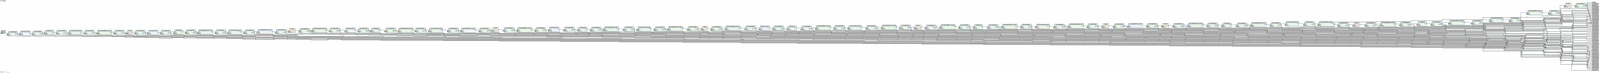
[diagram p0: block diagram of the top level, whole]
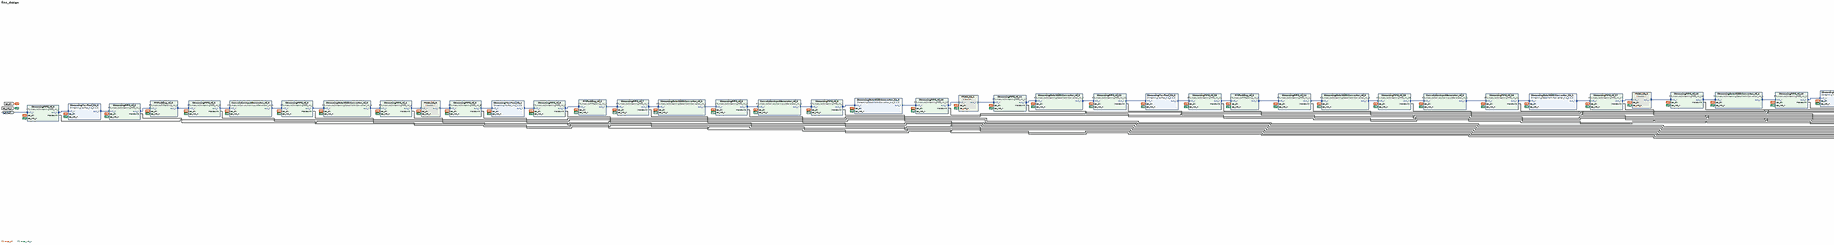
[diagram p1: block diagram of the top level, left part]
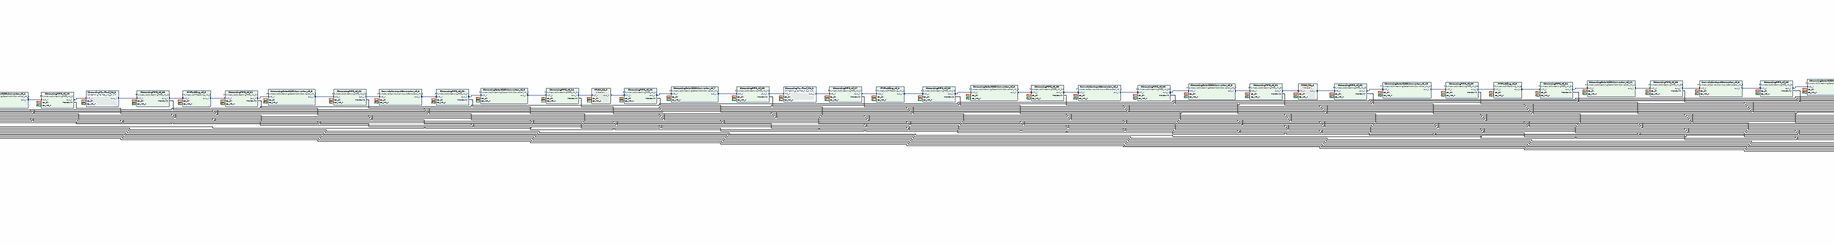
[diagram p2: block diagram of the top level, centre part]
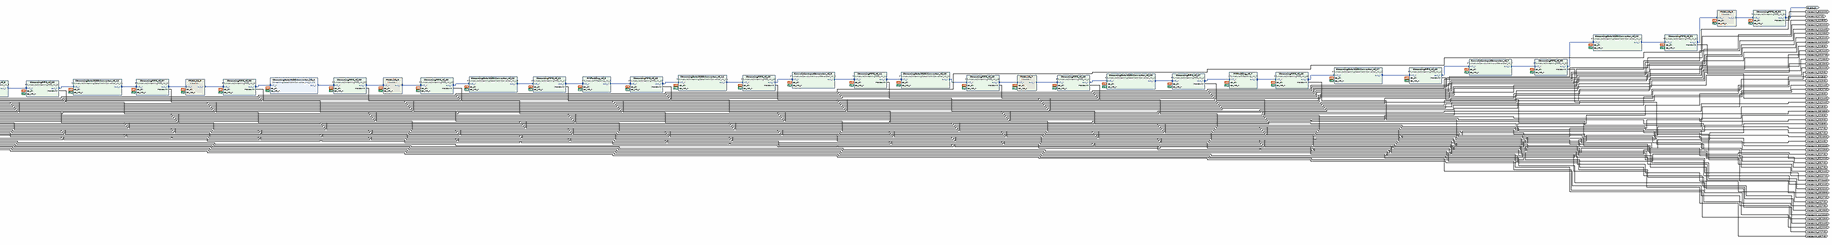
[diagram p3: block diagram of the top level, right part]
# Vivado block design finn_design, xc7z020clg400-1, Vivado 2022.2
create_bd_design finn_design

create_bd_intf_port -mode Slave -vlnv xilinx.com:interface:axis_rtl:1.0 s_axis_0
set_property -dict [list \
  CONFIG.HAS_TKEEP 0 \
  CONFIG.HAS_TLAST 0 \
  CONFIG.HAS_TREADY 1 \
  CONFIG.HAS_TSTRB 0 \
  CONFIG.LAYERED_METADATA undef \
  CONFIG.TDATA_NUM_BYTES 3 \
  CONFIG.TDEST_WIDTH 0 \
  CONFIG.TID_WIDTH 0 \
  CONFIG.TUSER_WIDTH 0 \
] [get_bd_intf_ports s_axis_0]
create_bd_intf_port -mode Master -vlnv xilinx.com:interface:axis_rtl:1.0 m_axis_0
create_bd_port -dir I -type clk ap_clk
set_property -dict {CONFIG.FREQ_HZ 100000000} [get_bd_ports ap_clk]
create_bd_port -dir I -type rst ap_rst_n
create_bd_port -dir O -from 17 -to 0 maxcount
create_bd_port -dir O -from 15 -to 0 maxcount_1
create_bd_port -dir O -from 15 -to 0 maxcount_2
create_bd_port -dir O -from 15 -to 0 maxcount_3
create_bd_port -dir O -from 18 -to 0 maxcount_4
create_bd_port -dir O -from 15 -to 0 maxcount_5
create_bd_port -dir O -from 13 -to 0 maxcount_6
create_bd_port -dir O -from 13 -to 0 maxcount_7
create_bd_port -dir O -from 14 -to 0 maxcount_8
create_bd_port -dir O -from 17 -to 0 maxcount_9
create_bd_port -dir O -from 16 -to 0 maxcount_10
create_bd_port -dir O -from 14 -to 0 maxcount_11
create_bd_port -dir O -from 13 -to 0 maxcount_12
create_bd_port -dir O -from 11 -to 0 maxcount_13
create_bd_port -dir O -from 11 -to 0 maxcount_14
create_bd_port -dir O -from 14 -to 0 maxcount_15
create_bd_port -dir O -from 17 -to 0 maxcount_16
create_bd_port -dir O -from 15 -to 0 maxcount_17
create_bd_port -dir O -from 13 -to 0 maxcount_18
create_bd_port -dir O -from 11 -to 0 maxcount_19
create_bd_port -dir O -from 9 -to 0 maxcount_20
create_bd_port -dir O -from 9 -to 0 maxcount_21
create_bd_port -dir O -from 14 -to 0 maxcount_22
create_bd_port -dir O -from 17 -to 0 maxcount_23
create_bd_port -dir O -from 14 -to 0 maxcount_24
create_bd_port -dir O -from 13 -to 0 maxcount_25
create_bd_port -dir O -from 9 -to 0 maxcount_26
create_bd_port -dir O -from 7 -to 0 maxcount_27
create_bd_port -dir O -from 7 -to 0 maxcount_28
create_bd_port -dir O -from 13 -to 0 maxcount_29
create_bd_port -dir O -from 16 -to 0 maxcount_30
create_bd_port -dir O -from 13 -to 0 maxcount_31
create_bd_port -dir O -from 12 -to 0 maxcount_32
create_bd_port -dir O -from 7 -to 0 maxcount_33
create_bd_port -dir O -from 7 -to 0 maxcount_34
create_bd_port -dir O -from 14 -to 0 maxcount_35
create_bd_port -dir O -from 17 -to 0 maxcount_36
create_bd_port -dir O -from 14 -to 0 maxcount_37
create_bd_port -dir O -from 11 -to 0 maxcount_38
create_bd_port -dir O -from 12 -to 0 maxcount_39
create_bd_port -dir O -from 13 -to 0 maxcount_40
create_bd_port -dir O -from 7 -to 0 maxcount_41
create_bd_port -dir O -from 7 -to 0 maxcount_42
create_bd_port -dir O -from 13 -to 0 maxcount_43
create_bd_port -dir O -from 16 -to 0 maxcount_44
create_bd_port -dir O -from 13 -to 0 maxcount_45
create_bd_port -dir O -from 12 -to 0 maxcount_46
create_bd_port -dir O -from 7 -to 0 maxcount_47
create_bd_port -dir O -from 7 -to 0 maxcount_48
create_bd_port -dir O -from 14 -to 0 maxcount_49
create_bd_port -dir O -from 17 -to 0 maxcount_50
create_bd_port -dir O -from 14 -to 0 maxcount_51
create_bd_port -dir O -from 11 -to 0 maxcount_52

create_bd_cell -type module -reference StreamingFIFO_rtl_0 StreamingFIFO_rtl_0
create_bd_cell -type ip -vlnv xilinx.com:hls:StreamingMaxPool_hls_0:1.0 StreamingMaxPool_hls_0
create_bd_cell -type module -reference StreamingFIFO_rtl_1 StreamingFIFO_rtl_1
create_bd_cell -type module -reference FMPadding_rtl_0 FMPadding_rtl_0
create_bd_cell -type module -reference StreamingFIFO_rtl_2 StreamingFIFO_rtl_2
create_bd_cell -type module -reference ConvolutionInputGenerator_rtl_0 ConvolutionInputGenerator_rtl_0
create_bd_cell -type module -reference StreamingFIFO_rtl_3 StreamingFIFO_rtl_3
create_bd_cell -type module -reference StreamingDataWidthConverter_rtl_0 StreamingDataWidthConverter_rtl_0
create_bd_cell -type module -reference StreamingFIFO_rtl_4 StreamingFIFO_rtl_4
create_bd_cell -type hier MVAU_hls_0
create_bd_cell -type module -reference StreamingFIFO_rtl_5 StreamingFIFO_rtl_5
create_bd_cell -type ip -vlnv xilinx.com:hls:StreamingMaxPool_hls_1:1.0 StreamingMaxPool_hls_1
create_bd_cell -type module -reference StreamingFIFO_rtl_6 StreamingFIFO_rtl_6
create_bd_cell -type module -reference FMPadding_rtl_1 FMPadding_rtl_1
create_bd_cell -type module -reference StreamingFIFO_rtl_7 StreamingFIFO_rtl_7
create_bd_cell -type module -reference StreamingDataWidthConverter_rtl_1 StreamingDataWidthConverter_rtl_1
create_bd_cell -type module -reference StreamingFIFO_rtl_8 StreamingFIFO_rtl_8
create_bd_cell -type module -reference ConvolutionInputGenerator_rtl_1 ConvolutionInputGenerator_rtl_1
create_bd_cell -type module -reference StreamingFIFO_rtl_9 StreamingFIFO_rtl_9
create_bd_cell -type ip -vlnv xilinx.com:hls:StreamingDataWidthConverter_hls_0:1.0 StreamingDataWidthConverter_hls_0
create_bd_cell -type module -reference StreamingFIFO_rtl_10 StreamingFIFO_rtl_10
create_bd_cell -type hier MVAU_hls_1
create_bd_cell -type module -reference StreamingFIFO_rtl_11 StreamingFIFO_rtl_11
create_bd_cell -type module -reference StreamingDataWidthConverter_rtl_2 StreamingDataWidthConverter_rtl_2
create_bd_cell -type module -reference StreamingFIFO_rtl_12 StreamingFIFO_rtl_12
create_bd_cell -type ip -vlnv xilinx.com:hls:StreamingMaxPool_hls_2:1.0 StreamingMaxPool_hls_2
create_bd_cell -type module -reference StreamingFIFO_rtl_13 StreamingFIFO_rtl_13
create_bd_cell -type module -reference FMPadding_rtl_2 FMPadding_rtl_2
create_bd_cell -type module -reference StreamingFIFO_rtl_14 StreamingFIFO_rtl_14
create_bd_cell -type module -reference StreamingDataWidthConverter_rtl_3 StreamingDataWidthConverter_rtl_3
create_bd_cell -type module -reference StreamingFIFO_rtl_15 StreamingFIFO_rtl_15
create_bd_cell -type module -reference ConvolutionInputGenerator_rtl_2 ConvolutionInputGenerator_rtl_2
create_bd_cell -type module -reference StreamingFIFO_rtl_16 StreamingFIFO_rtl_16
create_bd_cell -type ip -vlnv xilinx.com:hls:StreamingDataWidthConverter_hls_1:1.0 StreamingDataWidthConverter_hls_1
create_bd_cell -type module -reference StreamingFIFO_rtl_17 StreamingFIFO_rtl_17
create_bd_cell -type hier MVAU_hls_2
create_bd_cell -type module -reference StreamingFIFO_rtl_18 StreamingFIFO_rtl_18
create_bd_cell -type module -reference StreamingDataWidthConverter_rtl_4 StreamingDataWidthConverter_rtl_4
create_bd_cell -type module -reference StreamingFIFO_rtl_19 StreamingFIFO_rtl_19
create_bd_cell -type ip -vlnv xilinx.com:hls:StreamingMaxPool_hls_3:1.0 StreamingMaxPool_hls_3
create_bd_cell -type module -reference StreamingFIFO_rtl_20 StreamingFIFO_rtl_20
create_bd_cell -type module -reference FMPadding_rtl_3 FMPadding_rtl_3
create_bd_cell -type module -reference StreamingFIFO_rtl_21 StreamingFIFO_rtl_21
create_bd_cell -type module -reference StreamingDataWidthConverter_rtl_5 StreamingDataWidthConverter_rtl_5
create_bd_cell -type module -reference StreamingFIFO_rtl_22 StreamingFIFO_rtl_22
create_bd_cell -type module -reference ConvolutionInputGenerator_rtl_3 ConvolutionInputGenerator_rtl_3
create_bd_cell -type module -reference StreamingFIFO_rtl_23 StreamingFIFO_rtl_23
create_bd_cell -type module -reference StreamingDataWidthConverter_rtl_6 StreamingDataWidthConverter_rtl_6
create_bd_cell -type module -reference StreamingFIFO_rtl_24 StreamingFIFO_rtl_24
create_bd_cell -type hier MVAU_hls_3
create_bd_cell -type module -reference StreamingFIFO_rtl_25 StreamingFIFO_rtl_25
create_bd_cell -type module -reference StreamingDataWidthConverter_rtl_7 StreamingDataWidthConverter_rtl_7
create_bd_cell -type module -reference StreamingFIFO_rtl_26 StreamingFIFO_rtl_26
create_bd_cell -type ip -vlnv xilinx.com:hls:StreamingMaxPool_hls_4:1.0 StreamingMaxPool_hls_4
create_bd_cell -type module -reference StreamingFIFO_rtl_27 StreamingFIFO_rtl_27
create_bd_cell -type module -reference FMPadding_rtl_4 FMPadding_rtl_4
create_bd_cell -type module -reference StreamingFIFO_rtl_28 StreamingFIFO_rtl_28
create_bd_cell -type module -reference StreamingDataWidthConverter_rtl_8 StreamingDataWidthConverter_rtl_8
create_bd_cell -type module -reference StreamingFIFO_rtl_29 StreamingFIFO_rtl_29
create_bd_cell -type module -reference ConvolutionInputGenerator_rtl_4 ConvolutionInputGenerator_rtl_4
create_bd_cell -type module -reference StreamingFIFO_rtl_30 StreamingFIFO_rtl_30
create_bd_cell -type module -reference StreamingDataWidthConverter_rtl_9 StreamingDataWidthConverter_rtl_9
create_bd_cell -type module -reference StreamingFIFO_rtl_31 StreamingFIFO_rtl_31
create_bd_cell -type hier MVAU_hls_4
create_bd_cell -type module -reference StreamingFIFO_rtl_32 StreamingFIFO_rtl_32
create_bd_cell -type module -reference StreamingDataWidthConverter_rtl_10 StreamingDataWidthConverter_rtl_10
create_bd_cell -type module -reference StreamingFIFO_rtl_33 StreamingFIFO_rtl_33
create_bd_cell -type module -reference FMPadding_rtl_5 FMPadding_rtl_5
create_bd_cell -type module -reference StreamingFIFO_rtl_34 StreamingFIFO_rtl_34
create_bd_cell -type module -reference StreamingDataWidthConverter_rtl_11 StreamingDataWidthConverter_rtl_11
create_bd_cell -type module -reference StreamingFIFO_rtl_35 StreamingFIFO_rtl_35
create_bd_cell -type module -reference ConvolutionInputGenerator_rtl_5 ConvolutionInputGenerator_rtl_5
create_bd_cell -type module -reference StreamingFIFO_rtl_36 StreamingFIFO_rtl_36
create_bd_cell -type module -reference StreamingDataWidthConverter_rtl_12 StreamingDataWidthConverter_rtl_12
create_bd_cell -type module -reference StreamingFIFO_rtl_37 StreamingFIFO_rtl_37
create_bd_cell -type hier MVAU_hls_5
create_bd_cell -type module -reference StreamingFIFO_rtl_38 StreamingFIFO_rtl_38
create_bd_cell -type ip -vlnv xilinx.com:hls:StreamingDataWidthConverter_hls_2:1.0 StreamingDataWidthConverter_hls_2
create_bd_cell -type module -reference StreamingFIFO_rtl_39 StreamingFIFO_rtl_39
create_bd_cell -type hier MVAU_hls_6
create_bd_cell -type module -reference StreamingFIFO_rtl_40 StreamingFIFO_rtl_40
create_bd_cell -type module -reference StreamingDataWidthConverter_rtl_13 StreamingDataWidthConverter_rtl_13
create_bd_cell -type module -reference StreamingFIFO_rtl_41 StreamingFIFO_rtl_41
create_bd_cell -type module -reference FMPadding_rtl_6 FMPadding_rtl_6
create_bd_cell -type module -reference StreamingFIFO_rtl_42 StreamingFIFO_rtl_42
create_bd_cell -type module -reference StreamingDataWidthConverter_rtl_14 StreamingDataWidthConverter_rtl_14
create_bd_cell -type module -reference StreamingFIFO_rtl_43 StreamingFIFO_rtl_43
create_bd_cell -type module -reference ConvolutionInputGenerator_rtl_6 ConvolutionInputGenerator_rtl_6
create_bd_cell -type module -reference StreamingFIFO_rtl_44 StreamingFIFO_rtl_44
create_bd_cell -type module -reference StreamingDataWidthConverter_rtl_15 StreamingDataWidthConverter_rtl_15
create_bd_cell -type module -reference StreamingFIFO_rtl_45 StreamingFIFO_rtl_45
create_bd_cell -type hier MVAU_hls_7
create_bd_cell -type module -reference StreamingFIFO_rtl_46 StreamingFIFO_rtl_46
create_bd_cell -type module -reference StreamingDataWidthConverter_rtl_16 StreamingDataWidthConverter_rtl_16
create_bd_cell -type module -reference StreamingFIFO_rtl_47 StreamingFIFO_rtl_47
create_bd_cell -type module -reference FMPadding_rtl_7 FMPadding_rtl_7
create_bd_cell -type module -reference StreamingFIFO_rtl_48 StreamingFIFO_rtl_48
create_bd_cell -type module -reference StreamingDataWidthConverter_rtl_17 StreamingDataWidthConverter_rtl_17
create_bd_cell -type module -reference StreamingFIFO_rtl_49 StreamingFIFO_rtl_49
create_bd_cell -type module -reference ConvolutionInputGenerator_rtl_7 ConvolutionInputGenerator_rtl_7
create_bd_cell -type module -reference StreamingFIFO_rtl_50 StreamingFIFO_rtl_50
create_bd_cell -type module -reference StreamingDataWidthConverter_rtl_18 StreamingDataWidthConverter_rtl_18
create_bd_cell -type module -reference StreamingFIFO_rtl_51 StreamingFIFO_rtl_51
create_bd_cell -type hier MVAU_hls_8
create_bd_cell -type module -reference StreamingFIFO_rtl_52 StreamingFIFO_rtl_52

# ---- hierarchy /MVAU_hls_0 ----
current_bd_instance /MVAU_hls_0
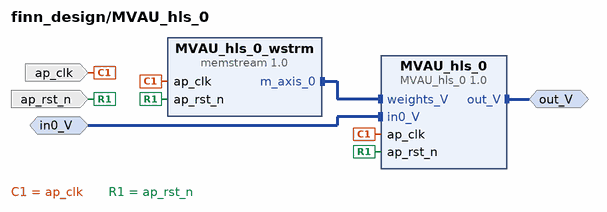
[diagram p4: block diagram inside /MVAU_hls_0]
create_bd_intf_pin -mode Master -vlnv xilinx.com:interface:axis_rtl:1.0 out_V
create_bd_intf_pin -mode Slave -vlnv xilinx.com:interface:axis_rtl:1.0 in0_V
create_bd_pin -dir I -type clk ap_clk
create_bd_pin -dir I -type rst ap_rst_n

create_bd_cell -type ip -vlnv xilinx.com:hls:MVAU_hls_0:1.0 MVAU_hls_0
create_bd_cell -type ip -vlnv amd.com:finn:memstream:1.0 MVAU_hls_0_wstrm
set_property -dict [list \
  CONFIG.DEPTH 8 \
  CONFIG.INIT_FILE /tmp/finn_dev_root/code_gen_ipgen_MVAU_hls_0_pm17mzbp/memblock.dat \
  CONFIG.RAM_STYLE auto \
  CONFIG.WIDTH 576 \
] [get_bd_cells MVAU_hls_0_wstrm]

# ---- hierarchy /MVAU_hls_1 ----
current_bd_instance /MVAU_hls_1
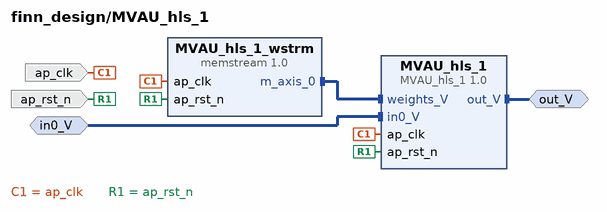
[diagram p5: block diagram inside /MVAU_hls_1]
create_bd_intf_pin -mode Master -vlnv xilinx.com:interface:axis_rtl:1.0 out_V
create_bd_intf_pin -mode Slave -vlnv xilinx.com:interface:axis_rtl:1.0 in0_V
create_bd_pin -dir I -type clk ap_clk
create_bd_pin -dir I -type rst ap_rst_n

create_bd_cell -type ip -vlnv xilinx.com:hls:MVAU_hls_1:1.0 MVAU_hls_1
create_bd_cell -type ip -vlnv amd.com:finn:memstream:1.0 MVAU_hls_1_wstrm
set_property -dict [list \
  CONFIG.DEPTH 16 \
  CONFIG.INIT_FILE /tmp/finn_dev_root/code_gen_ipgen_MVAU_hls_1_r23awlkq/memblock.dat \
  CONFIG.RAM_STYLE auto \
  CONFIG.WIDTH 576 \
] [get_bd_cells MVAU_hls_1_wstrm]

# ---- hierarchy /MVAU_hls_2 ----
current_bd_instance /MVAU_hls_2
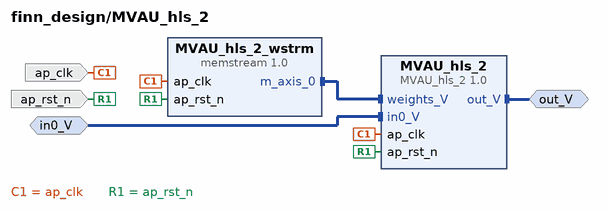
[diagram p6: block diagram inside /MVAU_hls_2]
create_bd_intf_pin -mode Master -vlnv xilinx.com:interface:axis_rtl:1.0 out_V
create_bd_intf_pin -mode Slave -vlnv xilinx.com:interface:axis_rtl:1.0 in0_V
create_bd_pin -dir I -type clk ap_clk
create_bd_pin -dir I -type rst ap_rst_n

create_bd_cell -type ip -vlnv xilinx.com:hls:MVAU_hls_2:1.0 MVAU_hls_2
create_bd_cell -type ip -vlnv amd.com:finn:memstream:1.0 MVAU_hls_2_wstrm
set_property -dict [list \
  CONFIG.DEPTH 64 \
  CONFIG.INIT_FILE /tmp/finn_dev_root/code_gen_ipgen_MVAU_hls_2_ufu323e_/memblock.dat \
  CONFIG.RAM_STYLE auto \
  CONFIG.WIDTH 576 \
] [get_bd_cells MVAU_hls_2_wstrm]

# ---- hierarchy /MVAU_hls_3 ----
current_bd_instance /MVAU_hls_3
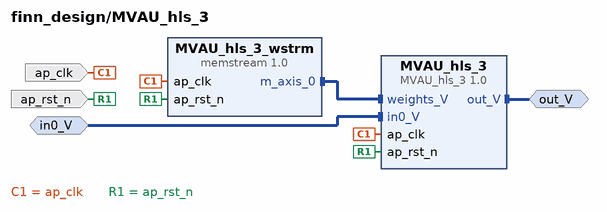
[diagram p7: block diagram inside /MVAU_hls_3]
create_bd_intf_pin -mode Master -vlnv xilinx.com:interface:axis_rtl:1.0 out_V
create_bd_intf_pin -mode Slave -vlnv xilinx.com:interface:axis_rtl:1.0 in0_V
create_bd_pin -dir I -type clk ap_clk
create_bd_pin -dir I -type rst ap_rst_n

create_bd_cell -type ip -vlnv xilinx.com:hls:MVAU_hls_3:1.0 MVAU_hls_3
create_bd_cell -type ip -vlnv amd.com:finn:memstream:1.0 MVAU_hls_3_wstrm
set_property -dict [list \
  CONFIG.DEPTH 448 \
  CONFIG.INIT_FILE /tmp/finn_dev_root/code_gen_ipgen_MVAU_hls_3_5vl2hbpw/memblock.dat \
  CONFIG.RAM_STYLE auto \
  CONFIG.WIDTH 288 \
] [get_bd_cells MVAU_hls_3_wstrm]

# ---- hierarchy /MVAU_hls_4 ----
current_bd_instance /MVAU_hls_4
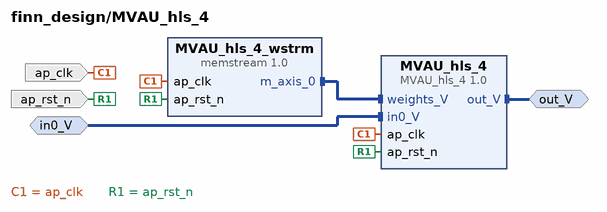
[diagram p8: block diagram inside /MVAU_hls_4]
create_bd_intf_pin -mode Master -vlnv xilinx.com:interface:axis_rtl:1.0 out_V
create_bd_intf_pin -mode Slave -vlnv xilinx.com:interface:axis_rtl:1.0 in0_V
create_bd_pin -dir I -type clk ap_clk
create_bd_pin -dir I -type rst ap_rst_n

create_bd_cell -type ip -vlnv xilinx.com:hls:MVAU_hls_4:1.0 MVAU_hls_4
create_bd_cell -type ip -vlnv amd.com:finn:memstream:1.0 MVAU_hls_4_wstrm
set_property -dict [list \
  CONFIG.DEPTH 1456 \
  CONFIG.INIT_FILE /tmp/finn_dev_root/code_gen_ipgen_MVAU_hls_4__ok_a9cj/memblock.dat \
  CONFIG.RAM_STYLE auto \
  CONFIG.WIDTH 288 \
] [get_bd_cells MVAU_hls_4_wstrm]

# ---- hierarchy /MVAU_hls_5 ----
current_bd_instance /MVAU_hls_5
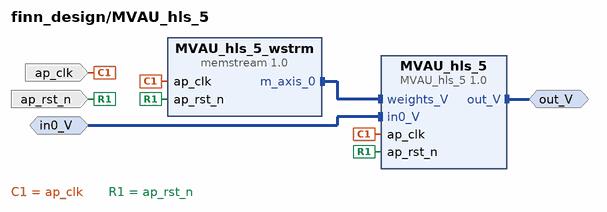
[diagram p9: block diagram inside /MVAU_hls_5]
create_bd_intf_pin -mode Master -vlnv xilinx.com:interface:axis_rtl:1.0 out_V
create_bd_intf_pin -mode Slave -vlnv xilinx.com:interface:axis_rtl:1.0 in0_V
create_bd_pin -dir I -type clk ap_clk
create_bd_pin -dir I -type rst ap_rst_n

create_bd_cell -type ip -vlnv xilinx.com:hls:MVAU_hls_5:1.0 MVAU_hls_5
create_bd_cell -type ip -vlnv amd.com:finn:memstream:1.0 MVAU_hls_5_wstrm
set_property -dict [list \
  CONFIG.DEPTH 1664 \
  CONFIG.INIT_FILE /tmp/finn_dev_root/code_gen_ipgen_MVAU_hls_5_ol2hz86g/memblock.dat \
  CONFIG.RAM_STYLE auto \
  CONFIG.WIDTH 936 \
] [get_bd_cells MVAU_hls_5_wstrm]

# ---- hierarchy /MVAU_hls_6 ----
current_bd_instance /MVAU_hls_6
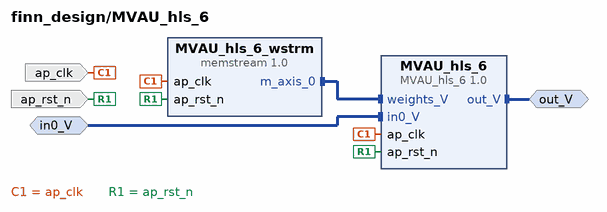
[diagram p10: block diagram inside /MVAU_hls_6]
create_bd_intf_pin -mode Master -vlnv xilinx.com:interface:axis_rtl:1.0 out_V
create_bd_intf_pin -mode Slave -vlnv xilinx.com:interface:axis_rtl:1.0 in0_V
create_bd_pin -dir I -type clk ap_clk
create_bd_pin -dir I -type rst ap_rst_n

create_bd_cell -type ip -vlnv xilinx.com:hls:MVAU_hls_6:1.0 MVAU_hls_6
create_bd_cell -type ip -vlnv amd.com:finn:memstream:1.0 MVAU_hls_6_wstrm
set_property -dict [list \
  CONFIG.DEPTH 1456 \
  CONFIG.INIT_FILE /tmp/finn_dev_root/code_gen_ipgen_MVAU_hls_6_y0qmdba0/memblock.dat \
  CONFIG.RAM_STYLE auto \
  CONFIG.WIDTH 64 \
] [get_bd_cells MVAU_hls_6_wstrm]

# ---- hierarchy /MVAU_hls_7 ----
current_bd_instance /MVAU_hls_7
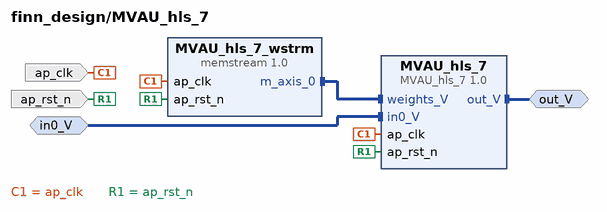
[diagram p11: block diagram inside /MVAU_hls_7]
create_bd_intf_pin -mode Master -vlnv xilinx.com:interface:axis_rtl:1.0 out_V
create_bd_intf_pin -mode Slave -vlnv xilinx.com:interface:axis_rtl:1.0 in0_V
create_bd_pin -dir I -type clk ap_clk
create_bd_pin -dir I -type rst ap_rst_n

create_bd_cell -type ip -vlnv xilinx.com:hls:MVAU_hls_7:1.0 MVAU_hls_7
create_bd_cell -type ip -vlnv amd.com:finn:memstream:1.0 MVAU_hls_7_wstrm
set_property -dict [list \
  CONFIG.DEPTH 1456 \
  CONFIG.INIT_FILE /tmp/finn_dev_root/code_gen_ipgen_MVAU_hls_7_urf094np/memblock.dat \
  CONFIG.RAM_STYLE auto \
  CONFIG.WIDTH 288 \
] [get_bd_cells MVAU_hls_7_wstrm]

# ---- hierarchy /MVAU_hls_8 ----
current_bd_instance /MVAU_hls_8
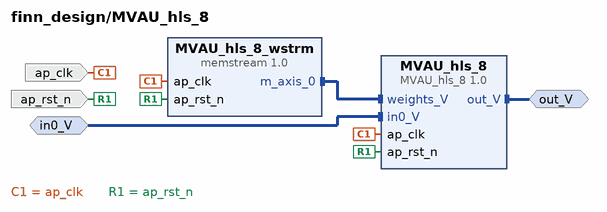
[diagram p12: block diagram inside /MVAU_hls_8]
create_bd_intf_pin -mode Master -vlnv xilinx.com:interface:axis_rtl:1.0 out_V
create_bd_intf_pin -mode Slave -vlnv xilinx.com:interface:axis_rtl:1.0 in0_V
create_bd_pin -dir I -type clk ap_clk
create_bd_pin -dir I -type rst ap_rst_n

create_bd_cell -type ip -vlnv xilinx.com:hls:MVAU_hls_8:1.0 MVAU_hls_8
create_bd_cell -type ip -vlnv amd.com:finn:memstream:1.0 MVAU_hls_8_wstrm
set_property -dict [list \
  CONFIG.DEPTH 1872 \
  CONFIG.INIT_FILE /tmp/finn_dev_root/code_gen_ipgen_MVAU_hls_8_p121gcnq/memblock.dat \
  CONFIG.RAM_STYLE auto \
  CONFIG.WIDTH 72 \
] [get_bd_cells MVAU_hls_8_wstrm]

# ---- connections ----

current_bd_instance /MVAU_hls_0
connect_bd_intf_net [get_bd_intf_pins out_V] [get_bd_intf_pins MVAU_hls_0/out_V]
connect_bd_intf_net [get_bd_intf_pins MVAU_hls_0_wstrm/m_axis_0] [get_bd_intf_pins MVAU_hls_0/weights_V]
connect_bd_intf_net [get_bd_intf_pins in0_V] [get_bd_intf_pins MVAU_hls_0/in0_V]
connect_bd_net [get_bd_pins ap_clk] [get_bd_pins MVAU_hls_0_wstrm/ap_clk] [get_bd_pins MVAU_hls_0/ap_clk]
connect_bd_net [get_bd_pins ap_rst_n] [get_bd_pins MVAU_hls_0_wstrm/ap_rst_n] [get_bd_pins MVAU_hls_0/ap_rst_n]

current_bd_instance /MVAU_hls_1
connect_bd_intf_net [get_bd_intf_pins out_V] [get_bd_intf_pins MVAU_hls_1/out_V]
connect_bd_intf_net [get_bd_intf_pins MVAU_hls_1_wstrm/m_axis_0] [get_bd_intf_pins MVAU_hls_1/weights_V]
connect_bd_intf_net [get_bd_intf_pins in0_V] [get_bd_intf_pins MVAU_hls_1/in0_V]
connect_bd_net [get_bd_pins ap_clk] [get_bd_pins MVAU_hls_1_wstrm/ap_clk] [get_bd_pins MVAU_hls_1/ap_clk]
connect_bd_net [get_bd_pins ap_rst_n] [get_bd_pins MVAU_hls_1_wstrm/ap_rst_n] [get_bd_pins MVAU_hls_1/ap_rst_n]

current_bd_instance /MVAU_hls_2
connect_bd_intf_net [get_bd_intf_pins out_V] [get_bd_intf_pins MVAU_hls_2/out_V]
connect_bd_intf_net [get_bd_intf_pins MVAU_hls_2_wstrm/m_axis_0] [get_bd_intf_pins MVAU_hls_2/weights_V]
connect_bd_intf_net [get_bd_intf_pins in0_V] [get_bd_intf_pins MVAU_hls_2/in0_V]
connect_bd_net [get_bd_pins ap_clk] [get_bd_pins MVAU_hls_2_wstrm/ap_clk] [get_bd_pins MVAU_hls_2/ap_clk]
connect_bd_net [get_bd_pins ap_rst_n] [get_bd_pins MVAU_hls_2_wstrm/ap_rst_n] [get_bd_pins MVAU_hls_2/ap_rst_n]

current_bd_instance /MVAU_hls_3
connect_bd_intf_net [get_bd_intf_pins out_V] [get_bd_intf_pins MVAU_hls_3/out_V]
connect_bd_intf_net [get_bd_intf_pins MVAU_hls_3_wstrm/m_axis_0] [get_bd_intf_pins MVAU_hls_3/weights_V]
connect_bd_intf_net [get_bd_intf_pins in0_V] [get_bd_intf_pins MVAU_hls_3/in0_V]
connect_bd_net [get_bd_pins ap_clk] [get_bd_pins MVAU_hls_3_wstrm/ap_clk] [get_bd_pins MVAU_hls_3/ap_clk]
connect_bd_net [get_bd_pins ap_rst_n] [get_bd_pins MVAU_hls_3_wstrm/ap_rst_n] [get_bd_pins MVAU_hls_3/ap_rst_n]

current_bd_instance /MVAU_hls_4
connect_bd_intf_net [get_bd_intf_pins out_V] [get_bd_intf_pins MVAU_hls_4/out_V]
connect_bd_intf_net [get_bd_intf_pins MVAU_hls_4_wstrm/m_axis_0] [get_bd_intf_pins MVAU_hls_4/weights_V]
connect_bd_intf_net [get_bd_intf_pins in0_V] [get_bd_intf_pins MVAU_hls_4/in0_V]
connect_bd_net [get_bd_pins ap_clk] [get_bd_pins MVAU_hls_4_wstrm/ap_clk] [get_bd_pins MVAU_hls_4/ap_clk]
connect_bd_net [get_bd_pins ap_rst_n] [get_bd_pins MVAU_hls_4_wstrm/ap_rst_n] [get_bd_pins MVAU_hls_4/ap_rst_n]

current_bd_instance /MVAU_hls_5
connect_bd_intf_net [get_bd_intf_pins out_V] [get_bd_intf_pins MVAU_hls_5/out_V]
connect_bd_intf_net [get_bd_intf_pins MVAU_hls_5_wstrm/m_axis_0] [get_bd_intf_pins MVAU_hls_5/weights_V]
connect_bd_intf_net [get_bd_intf_pins in0_V] [get_bd_intf_pins MVAU_hls_5/in0_V]
connect_bd_net [get_bd_pins ap_clk] [get_bd_pins MVAU_hls_5_wstrm/ap_clk] [get_bd_pins MVAU_hls_5/ap_clk]
connect_bd_net [get_bd_pins ap_rst_n] [get_bd_pins MVAU_hls_5_wstrm/ap_rst_n] [get_bd_pins MVAU_hls_5/ap_rst_n]

current_bd_instance /MVAU_hls_6
connect_bd_intf_net [get_bd_intf_pins out_V] [get_bd_intf_pins MVAU_hls_6/out_V]
connect_bd_intf_net [get_bd_intf_pins MVAU_hls_6_wstrm/m_axis_0] [get_bd_intf_pins MVAU_hls_6/weights_V]
connect_bd_intf_net [get_bd_intf_pins in0_V] [get_bd_intf_pins MVAU_hls_6/in0_V]
connect_bd_net [get_bd_pins ap_clk] [get_bd_pins MVAU_hls_6_wstrm/ap_clk] [get_bd_pins MVAU_hls_6/ap_clk]
connect_bd_net [get_bd_pins ap_rst_n] [get_bd_pins MVAU_hls_6_wstrm/ap_rst_n] [get_bd_pins MVAU_hls_6/ap_rst_n]

current_bd_instance /MVAU_hls_7
connect_bd_intf_net [get_bd_intf_pins out_V] [get_bd_intf_pins MVAU_hls_7/out_V]
connect_bd_intf_net [get_bd_intf_pins MVAU_hls_7_wstrm/m_axis_0] [get_bd_intf_pins MVAU_hls_7/weights_V]
connect_bd_intf_net [get_bd_intf_pins in0_V] [get_bd_intf_pins MVAU_hls_7/in0_V]
connect_bd_net [get_bd_pins ap_clk] [get_bd_pins MVAU_hls_7_wstrm/ap_clk] [get_bd_pins MVAU_hls_7/ap_clk]
connect_bd_net [get_bd_pins ap_rst_n] [get_bd_pins MVAU_hls_7_wstrm/ap_rst_n] [get_bd_pins MVAU_hls_7/ap_rst_n]

current_bd_instance /MVAU_hls_8
connect_bd_intf_net [get_bd_intf_pins out_V] [get_bd_intf_pins MVAU_hls_8/out_V]
connect_bd_intf_net [get_bd_intf_pins MVAU_hls_8_wstrm/m_axis_0] [get_bd_intf_pins MVAU_hls_8/weights_V]
connect_bd_intf_net [get_bd_intf_pins in0_V] [get_bd_intf_pins MVAU_hls_8/in0_V]
connect_bd_net [get_bd_pins ap_clk] [get_bd_pins MVAU_hls_8_wstrm/ap_clk] [get_bd_pins MVAU_hls_8/ap_clk]
connect_bd_net [get_bd_pins ap_rst_n] [get_bd_pins MVAU_hls_8_wstrm/ap_rst_n] [get_bd_pins MVAU_hls_8/ap_rst_n]

current_bd_instance /
connect_bd_intf_net [get_bd_intf_pins ConvolutionInputGenerator_rtl_0/out_V] [get_bd_intf_pins StreamingFIFO_rtl_3/in0_V]
connect_bd_intf_net [get_bd_intf_pins ConvolutionInputGenerator_rtl_1/out_V] [get_bd_intf_pins StreamingFIFO_rtl_9/in0_V]
connect_bd_intf_net [get_bd_intf_pins ConvolutionInputGenerator_rtl_2/out_V] [get_bd_intf_pins StreamingFIFO_rtl_16/in0_V]
connect_bd_intf_net [get_bd_intf_pins ConvolutionInputGenerator_rtl_3/out_V] [get_bd_intf_pins StreamingFIFO_rtl_23/in0_V]
connect_bd_intf_net [get_bd_intf_pins ConvolutionInputGenerator_rtl_4/out_V] [get_bd_intf_pins StreamingFIFO_rtl_30/in0_V]
connect_bd_intf_net [get_bd_intf_pins ConvolutionInputGenerator_rtl_5/out_V] [get_bd_intf_pins StreamingFIFO_rtl_36/in0_V]
connect_bd_intf_net [get_bd_intf_pins ConvolutionInputGenerator_rtl_6/out_V] [get_bd_intf_pins StreamingFIFO_rtl_44/in0_V]
connect_bd_intf_net [get_bd_intf_pins ConvolutionInputGenerator_rtl_7/out_V] [get_bd_intf_pins StreamingFIFO_rtl_50/in0_V]
connect_bd_intf_net [get_bd_intf_pins FMPadding_rtl_0/out_V] [get_bd_intf_pins StreamingFIFO_rtl_2/in0_V]
connect_bd_intf_net [get_bd_intf_pins FMPadding_rtl_1/out_V] [get_bd_intf_pins StreamingFIFO_rtl_7/in0_V]
connect_bd_intf_net [get_bd_intf_pins FMPadding_rtl_2/out_V] [get_bd_intf_pins StreamingFIFO_rtl_14/in0_V]
connect_bd_intf_net [get_bd_intf_pins FMPadding_rtl_3/out_V] [get_bd_intf_pins StreamingFIFO_rtl_21/in0_V]
connect_bd_intf_net [get_bd_intf_pins FMPadding_rtl_4/out_V] [get_bd_intf_pins StreamingFIFO_rtl_28/in0_V]
connect_bd_intf_net [get_bd_intf_pins FMPadding_rtl_5/out_V] [get_bd_intf_pins StreamingFIFO_rtl_34/in0_V]
connect_bd_intf_net [get_bd_intf_pins FMPadding_rtl_6/out_V] [get_bd_intf_pins StreamingFIFO_rtl_42/in0_V]
connect_bd_intf_net [get_bd_intf_pins FMPadding_rtl_7/out_V] [get_bd_intf_pins StreamingFIFO_rtl_48/in0_V]
connect_bd_intf_net [get_bd_intf_pins MVAU_hls_0/out_V] [get_bd_intf_pins StreamingFIFO_rtl_5/in0_V]
connect_bd_intf_net [get_bd_intf_pins MVAU_hls_1/out_V] [get_bd_intf_pins StreamingFIFO_rtl_11/in0_V]
connect_bd_intf_net [get_bd_intf_pins MVAU_hls_2/out_V] [get_bd_intf_pins StreamingFIFO_rtl_18/in0_V]
connect_bd_intf_net [get_bd_intf_pins MVAU_hls_3/out_V] [get_bd_intf_pins StreamingFIFO_rtl_25/in0_V]
connect_bd_intf_net [get_bd_intf_pins MVAU_hls_4/out_V] [get_bd_intf_pins StreamingFIFO_rtl_32/in0_V]
connect_bd_intf_net [get_bd_intf_pins MVAU_hls_5/out_V] [get_bd_intf_pins StreamingFIFO_rtl_38/in0_V]
connect_bd_intf_net [get_bd_intf_pins MVAU_hls_6/out_V] [get_bd_intf_pins StreamingFIFO_rtl_40/in0_V]
connect_bd_intf_net [get_bd_intf_pins MVAU_hls_7/out_V] [get_bd_intf_pins StreamingFIFO_rtl_46/in0_V]
connect_bd_intf_net [get_bd_intf_pins MVAU_hls_8/out_V] [get_bd_intf_pins StreamingFIFO_rtl_52/in0_V]
connect_bd_intf_net [get_bd_intf_pins StreamingDataWidthConverter_hls_0/out_V] [get_bd_intf_pins StreamingFIFO_rtl_10/in0_V]
connect_bd_intf_net [get_bd_intf_pins StreamingDataWidthConverter_hls_1/out_V] [get_bd_intf_pins StreamingFIFO_rtl_17/in0_V]
connect_bd_intf_net [get_bd_intf_pins StreamingDataWidthConverter_hls_2/out_V] [get_bd_intf_pins StreamingFIFO_rtl_39/in0_V]
connect_bd_intf_net [get_bd_intf_pins StreamingDataWidthConverter_rtl_0/out_V] [get_bd_intf_pins StreamingFIFO_rtl_4/in0_V]
connect_bd_intf_net [get_bd_intf_pins StreamingDataWidthConverter_rtl_10/out_V] [get_bd_intf_pins StreamingFIFO_rtl_33/in0_V]
connect_bd_intf_net [get_bd_intf_pins StreamingDataWidthConverter_rtl_11/out_V] [get_bd_intf_pins StreamingFIFO_rtl_35/in0_V]
connect_bd_intf_net [get_bd_intf_pins StreamingDataWidthConverter_rtl_12/out_V] [get_bd_intf_pins StreamingFIFO_rtl_37/in0_V]
connect_bd_intf_net [get_bd_intf_pins StreamingDataWidthConverter_rtl_13/out_V] [get_bd_intf_pins StreamingFIFO_rtl_41/in0_V]
connect_bd_intf_net [get_bd_intf_pins StreamingDataWidthConverter_rtl_14/out_V] [get_bd_intf_pins StreamingFIFO_rtl_43/in0_V]
connect_bd_intf_net [get_bd_intf_pins StreamingDataWidthConverter_rtl_15/out_V] [get_bd_intf_pins StreamingFIFO_rtl_45/in0_V]
connect_bd_intf_net [get_bd_intf_pins StreamingDataWidthConverter_rtl_16/out_V] [get_bd_intf_pins StreamingFIFO_rtl_47/in0_V]
connect_bd_intf_net [get_bd_intf_pins StreamingDataWidthConverter_rtl_17/out_V] [get_bd_intf_pins StreamingFIFO_rtl_49/in0_V]
connect_bd_intf_net [get_bd_intf_pins StreamingDataWidthConverter_rtl_18/out_V] [get_bd_intf_pins StreamingFIFO_rtl_51/in0_V]
connect_bd_intf_net [get_bd_intf_pins StreamingDataWidthConverter_rtl_1/out_V] [get_bd_intf_pins StreamingFIFO_rtl_8/in0_V]
connect_bd_intf_net [get_bd_intf_pins StreamingDataWidthConverter_rtl_2/out_V] [get_bd_intf_pins StreamingFIFO_rtl_12/in0_V]
connect_bd_intf_net [get_bd_intf_pins StreamingDataWidthConverter_rtl_3/out_V] [get_bd_intf_pins StreamingFIFO_rtl_15/in0_V]
connect_bd_intf_net [get_bd_intf_pins StreamingDataWidthConverter_rtl_4/out_V] [get_bd_intf_pins StreamingFIFO_rtl_19/in0_V]
connect_bd_intf_net [get_bd_intf_pins StreamingDataWidthConverter_rtl_5/out_V] [get_bd_intf_pins StreamingFIFO_rtl_22/in0_V]
connect_bd_intf_net [get_bd_intf_pins StreamingDataWidthConverter_rtl_6/out_V] [get_bd_intf_pins StreamingFIFO_rtl_24/in0_V]
connect_bd_intf_net [get_bd_intf_pins StreamingDataWidthConverter_rtl_7/out_V] [get_bd_intf_pins StreamingFIFO_rtl_26/in0_V]
connect_bd_intf_net [get_bd_intf_pins StreamingDataWidthConverter_rtl_8/out_V] [get_bd_intf_pins StreamingFIFO_rtl_29/in0_V]
connect_bd_intf_net [get_bd_intf_pins StreamingDataWidthConverter_rtl_9/out_V] [get_bd_intf_pins StreamingFIFO_rtl_31/in0_V]
connect_bd_intf_net [get_bd_intf_pins StreamingFIFO_rtl_0/out_V] [get_bd_intf_pins StreamingMaxPool_hls_0/in0_V]
connect_bd_intf_net [get_bd_intf_pins StreamingFIFO_rtl_10/out_V] [get_bd_intf_pins MVAU_hls_1/in0_V]
connect_bd_intf_net [get_bd_intf_pins StreamingFIFO_rtl_11/out_V] [get_bd_intf_pins StreamingDataWidthConverter_rtl_2/in0_V]
connect_bd_intf_net [get_bd_intf_pins StreamingFIFO_rtl_12/out_V] [get_bd_intf_pins StreamingMaxPool_hls_2/in0_V]
connect_bd_intf_net [get_bd_intf_pins StreamingFIFO_rtl_13/out_V] [get_bd_intf_pins FMPadding_rtl_2/in0_V]
connect_bd_intf_net [get_bd_intf_pins StreamingFIFO_rtl_14/out_V] [get_bd_intf_pins StreamingDataWidthConverter_rtl_3/in0_V]
connect_bd_intf_net [get_bd_intf_pins StreamingFIFO_rtl_15/out_V] [get_bd_intf_pins ConvolutionInputGenerator_rtl_2/in0_V]
connect_bd_intf_net [get_bd_intf_pins StreamingFIFO_rtl_16/out_V] [get_bd_intf_pins StreamingDataWidthConverter_hls_1/in0_V]
connect_bd_intf_net [get_bd_intf_pins StreamingFIFO_rtl_17/out_V] [get_bd_intf_pins MVAU_hls_2/in0_V]
connect_bd_intf_net [get_bd_intf_pins StreamingFIFO_rtl_18/out_V] [get_bd_intf_pins StreamingDataWidthConverter_rtl_4/in0_V]
connect_bd_intf_net [get_bd_intf_pins StreamingFIFO_rtl_19/out_V] [get_bd_intf_pins StreamingMaxPool_hls_3/in0_V]
connect_bd_intf_net [get_bd_intf_pins StreamingFIFO_rtl_1/out_V] [get_bd_intf_pins FMPadding_rtl_0/in0_V]
connect_bd_intf_net [get_bd_intf_pins StreamingFIFO_rtl_20/out_V] [get_bd_intf_pins FMPadding_rtl_3/in0_V]
connect_bd_intf_net [get_bd_intf_pins StreamingFIFO_rtl_21/out_V] [get_bd_intf_pins StreamingDataWidthConverter_rtl_5/in0_V]
connect_bd_intf_net [get_bd_intf_pins StreamingFIFO_rtl_22/out_V] [get_bd_intf_pins ConvolutionInputGenerator_rtl_3/in0_V]
connect_bd_intf_net [get_bd_intf_pins StreamingFIFO_rtl_23/out_V] [get_bd_intf_pins StreamingDataWidthConverter_rtl_6/in0_V]
connect_bd_intf_net [get_bd_intf_pins StreamingFIFO_rtl_24/out_V] [get_bd_intf_pins MVAU_hls_3/in0_V]
connect_bd_intf_net [get_bd_intf_pins StreamingFIFO_rtl_25/out_V] [get_bd_intf_pins StreamingDataWidthConverter_rtl_7/in0_V]
connect_bd_intf_net [get_bd_intf_pins StreamingFIFO_rtl_26/out_V] [get_bd_intf_pins StreamingMaxPool_hls_4/in0_V]
connect_bd_intf_net [get_bd_intf_pins StreamingFIFO_rtl_27/out_V] [get_bd_intf_pins FMPadding_rtl_4/in0_V]
connect_bd_intf_net [get_bd_intf_pins StreamingFIFO_rtl_28/out_V] [get_bd_intf_pins StreamingDataWidthConverter_rtl_8/in0_V]
connect_bd_intf_net [get_bd_intf_pins StreamingFIFO_rtl_29/out_V] [get_bd_intf_pins ConvolutionInputGenerator_rtl_4/in0_V]
connect_bd_intf_net [get_bd_intf_pins StreamingFIFO_rtl_2/out_V] [get_bd_intf_pins ConvolutionInputGenerator_rtl_0/in0_V]
connect_bd_intf_net [get_bd_intf_pins StreamingFIFO_rtl_30/out_V] [get_bd_intf_pins StreamingDataWidthConverter_rtl_9/in0_V]
connect_bd_intf_net [get_bd_intf_pins StreamingFIFO_rtl_31/out_V] [get_bd_intf_pins MVAU_hls_4/in0_V]
connect_bd_intf_net [get_bd_intf_pins StreamingFIFO_rtl_32/out_V] [get_bd_intf_pins StreamingDataWidthConverter_rtl_10/in0_V]
connect_bd_intf_net [get_bd_intf_pins StreamingFIFO_rtl_33/out_V] [get_bd_intf_pins FMPadding_rtl_5/in0_V]
connect_bd_intf_net [get_bd_intf_pins StreamingFIFO_rtl_34/out_V] [get_bd_intf_pins StreamingDataWidthConverter_rtl_11/in0_V]
connect_bd_intf_net [get_bd_intf_pins StreamingFIFO_rtl_35/out_V] [get_bd_intf_pins ConvolutionInputGenerator_rtl_5/in0_V]
connect_bd_intf_net [get_bd_intf_pins StreamingFIFO_rtl_36/out_V] [get_bd_intf_pins StreamingDataWidthConverter_rtl_12/in0_V]
connect_bd_intf_net [get_bd_intf_pins StreamingFIFO_rtl_37/out_V] [get_bd_intf_pins MVAU_hls_5/in0_V]
connect_bd_intf_net [get_bd_intf_pins StreamingFIFO_rtl_38/out_V] [get_bd_intf_pins StreamingDataWidthConverter_hls_2/in0_V]
connect_bd_intf_net [get_bd_intf_pins StreamingFIFO_rtl_39/out_V] [get_bd_intf_pins MVAU_hls_6/in0_V]
connect_bd_intf_net [get_bd_intf_pins StreamingFIFO_rtl_3/out_V] [get_bd_intf_pins StreamingDataWidthConverter_rtl_0/in0_V]
connect_bd_intf_net [get_bd_intf_pins StreamingFIFO_rtl_40/out_V] [get_bd_intf_pins StreamingDataWidthConverter_rtl_13/in0_V]
connect_bd_intf_net [get_bd_intf_pins StreamingFIFO_rtl_41/out_V] [get_bd_intf_pins FMPadding_rtl_6/in0_V]
connect_bd_intf_net [get_bd_intf_pins StreamingFIFO_rtl_42/out_V] [get_bd_intf_pins StreamingDataWidthConverter_rtl_14/in0_V]
connect_bd_intf_net [get_bd_intf_pins StreamingFIFO_rtl_43/out_V] [get_bd_intf_pins ConvolutionInputGenerator_rtl_6/in0_V]
connect_bd_intf_net [get_bd_intf_pins StreamingFIFO_rtl_44/out_V] [get_bd_intf_pins StreamingDataWidthConverter_rtl_15/in0_V]
connect_bd_intf_net [get_bd_intf_pins StreamingFIFO_rtl_45/out_V] [get_bd_intf_pins MVAU_hls_7/in0_V]
connect_bd_intf_net [get_bd_intf_pins StreamingFIFO_rtl_46/out_V] [get_bd_intf_pins StreamingDataWidthConverter_rtl_16/in0_V]
connect_bd_intf_net [get_bd_intf_pins StreamingFIFO_rtl_47/out_V] [get_bd_intf_pins FMPadding_rtl_7/in0_V]
connect_bd_intf_net [get_bd_intf_pins StreamingFIFO_rtl_48/out_V] [get_bd_intf_pins StreamingDataWidthConverter_rtl_17/in0_V]
connect_bd_intf_net [get_bd_intf_pins StreamingFIFO_rtl_49/out_V] [get_bd_intf_pins ConvolutionInputGenerator_rtl_7/in0_V]
connect_bd_intf_net [get_bd_intf_pins StreamingFIFO_rtl_4/out_V] [get_bd_intf_pins MVAU_hls_0/in0_V]
connect_bd_intf_net [get_bd_intf_pins StreamingFIFO_rtl_50/out_V] [get_bd_intf_pins StreamingDataWidthConverter_rtl_18/in0_V]
connect_bd_intf_net [get_bd_intf_pins StreamingFIFO_rtl_51/out_V] [get_bd_intf_pins MVAU_hls_8/in0_V]
connect_bd_intf_net [get_bd_intf_ports m_axis_0] [get_bd_intf_pins StreamingFIFO_rtl_52/out_V]
connect_bd_intf_net [get_bd_intf_pins StreamingFIFO_rtl_5/out_V] [get_bd_intf_pins StreamingMaxPool_hls_1/in0_V]
connect_bd_intf_net [get_bd_intf_pins StreamingFIFO_rtl_6/out_V] [get_bd_intf_pins FMPadding_rtl_1/in0_V]
connect_bd_intf_net [get_bd_intf_pins StreamingFIFO_rtl_7/out_V] [get_bd_intf_pins StreamingDataWidthConverter_rtl_1/in0_V]
connect_bd_intf_net [get_bd_intf_pins StreamingFIFO_rtl_8/out_V] [get_bd_intf_pins ConvolutionInputGenerator_rtl_1/in0_V]
connect_bd_intf_net [get_bd_intf_pins StreamingFIFO_rtl_9/out_V] [get_bd_intf_pins StreamingDataWidthConverter_hls_0/in0_V]
connect_bd_intf_net [get_bd_intf_pins StreamingMaxPool_hls_0/out_V] [get_bd_intf_pins StreamingFIFO_rtl_1/in0_V]
connect_bd_intf_net [get_bd_intf_pins StreamingMaxPool_hls_1/out_V] [get_bd_intf_pins StreamingFIFO_rtl_6/in0_V]
connect_bd_intf_net [get_bd_intf_pins StreamingMaxPool_hls_2/out_V] [get_bd_intf_pins StreamingFIFO_rtl_13/in0_V]
connect_bd_intf_net [get_bd_intf_pins StreamingMaxPool_hls_3/out_V] [get_bd_intf_pins StreamingFIFO_rtl_20/in0_V]
connect_bd_intf_net [get_bd_intf_pins StreamingMaxPool_hls_4/out_V] [get_bd_intf_pins StreamingFIFO_rtl_27/in0_V]
connect_bd_intf_net -intf_net in0_V_0_1 [get_bd_intf_ports s_axis_0] [get_bd_intf_pins StreamingFIFO_rtl_0/in0_V]
connect_bd_net [get_bd_pins StreamingFIFO_rtl_0/maxcount] [get_bd_ports maxcount]
connect_bd_net [get_bd_pins StreamingFIFO_rtl_10/maxcount] [get_bd_ports maxcount_10]
connect_bd_net [get_bd_pins StreamingFIFO_rtl_11/maxcount] [get_bd_ports maxcount_11]
connect_bd_net [get_bd_pins StreamingFIFO_rtl_12/maxcount] [get_bd_ports maxcount_12]
connect_bd_net [get_bd_pins StreamingFIFO_rtl_13/maxcount] [get_bd_ports maxcount_13]
connect_bd_net [get_bd_pins StreamingFIFO_rtl_14/maxcount] [get_bd_ports maxcount_14]
connect_bd_net [get_bd_pins StreamingFIFO_rtl_15/maxcount] [get_bd_ports maxcount_15]
connect_bd_net [get_bd_pins StreamingFIFO_rtl_16/maxcount] [get_bd_ports maxcount_16]
connect_bd_net [get_bd_pins StreamingFIFO_rtl_17/maxcount] [get_bd_ports maxcount_17]
connect_bd_net [get_bd_pins StreamingFIFO_rtl_18/maxcount] [get_bd_ports maxcount_18]
connect_bd_net [get_bd_pins StreamingFIFO_rtl_19/maxcount] [get_bd_ports maxcount_19]
connect_bd_net [get_bd_pins StreamingFIFO_rtl_1/maxcount] [get_bd_ports maxcount_1]
connect_bd_net [get_bd_pins StreamingFIFO_rtl_20/maxcount] [get_bd_ports maxcount_20]
connect_bd_net [get_bd_pins StreamingFIFO_rtl_21/maxcount] [get_bd_ports maxcount_21]
connect_bd_net [get_bd_pins StreamingFIFO_rtl_22/maxcount] [get_bd_ports maxcount_22]
connect_bd_net [get_bd_pins StreamingFIFO_rtl_23/maxcount] [get_bd_ports maxcount_23]
connect_bd_net [get_bd_pins StreamingFIFO_rtl_24/maxcount] [get_bd_ports maxcount_24]
connect_bd_net [get_bd_pins StreamingFIFO_rtl_25/maxcount] [get_bd_ports maxcount_25]
connect_bd_net [get_bd_pins StreamingFIFO_rtl_26/maxcount] [get_bd_ports maxcount_26]
connect_bd_net [get_bd_pins StreamingFIFO_rtl_27/maxcount] [get_bd_ports maxcount_27]
connect_bd_net [get_bd_pins StreamingFIFO_rtl_28/maxcount] [get_bd_ports maxcount_28]
connect_bd_net [get_bd_pins StreamingFIFO_rtl_29/maxcount] [get_bd_ports maxcount_29]
connect_bd_net [get_bd_pins StreamingFIFO_rtl_2/maxcount] [get_bd_ports maxcount_2]
connect_bd_net [get_bd_pins StreamingFIFO_rtl_30/maxcount] [get_bd_ports maxcount_30]
connect_bd_net [get_bd_pins StreamingFIFO_rtl_31/maxcount] [get_bd_ports maxcount_31]
connect_bd_net [get_bd_pins StreamingFIFO_rtl_32/maxcount] [get_bd_ports maxcount_32]
connect_bd_net [get_bd_pins StreamingFIFO_rtl_33/maxcount] [get_bd_ports maxcount_33]
connect_bd_net [get_bd_pins StreamingFIFO_rtl_34/maxcount] [get_bd_ports maxcount_34]
connect_bd_net [get_bd_pins StreamingFIFO_rtl_35/maxcount] [get_bd_ports maxcount_35]
connect_bd_net [get_bd_pins StreamingFIFO_rtl_36/maxcount] [get_bd_ports maxcount_36]
connect_bd_net [get_bd_pins StreamingFIFO_rtl_37/maxcount] [get_bd_ports maxcount_37]
connect_bd_net [get_bd_pins StreamingFIFO_rtl_38/maxcount] [get_bd_ports maxcount_38]
connect_bd_net [get_bd_pins StreamingFIFO_rtl_39/maxcount] [get_bd_ports maxcount_39]
connect_bd_net [get_bd_pins StreamingFIFO_rtl_3/maxcount] [get_bd_ports maxcount_3]
connect_bd_net [get_bd_pins StreamingFIFO_rtl_40/maxcount] [get_bd_ports maxcount_40]
connect_bd_net [get_bd_pins StreamingFIFO_rtl_41/maxcount] [get_bd_ports maxcount_41]
connect_bd_net [get_bd_pins StreamingFIFO_rtl_42/maxcount] [get_bd_ports maxcount_42]
connect_bd_net [get_bd_pins StreamingFIFO_rtl_43/maxcount] [get_bd_ports maxcount_43]
connect_bd_net [get_bd_pins StreamingFIFO_rtl_44/maxcount] [get_bd_ports maxcount_44]
connect_bd_net [get_bd_pins StreamingFIFO_rtl_45/maxcount] [get_bd_ports maxcount_45]
connect_bd_net [get_bd_pins StreamingFIFO_rtl_46/maxcount] [get_bd_ports maxcount_46]
connect_bd_net [get_bd_pins StreamingFIFO_rtl_47/maxcount] [get_bd_ports maxcount_47]
connect_bd_net [get_bd_pins StreamingFIFO_rtl_48/maxcount] [get_bd_ports maxcount_48]
connect_bd_net [get_bd_pins StreamingFIFO_rtl_49/maxcount] [get_bd_ports maxcount_49]
connect_bd_net [get_bd_pins StreamingFIFO_rtl_4/maxcount] [get_bd_ports maxcount_4]
connect_bd_net [get_bd_pins StreamingFIFO_rtl_50/maxcount] [get_bd_ports maxcount_50]
connect_bd_net [get_bd_pins StreamingFIFO_rtl_51/maxcount] [get_bd_ports maxcount_51]
connect_bd_net [get_bd_pins StreamingFIFO_rtl_52/maxcount] [get_bd_ports maxcount_52]
connect_bd_net [get_bd_pins StreamingFIFO_rtl_5/maxcount] [get_bd_ports maxcount_5]
connect_bd_net [get_bd_pins StreamingFIFO_rtl_6/maxcount] [get_bd_ports maxcount_6]
connect_bd_net [get_bd_pins StreamingFIFO_rtl_7/maxcount] [get_bd_ports maxcount_7]
connect_bd_net [get_bd_pins StreamingFIFO_rtl_8/maxcount] [get_bd_ports maxcount_8]
connect_bd_net [get_bd_pins StreamingFIFO_rtl_9/maxcount] [get_bd_ports maxcount_9]
connect_bd_net -net ap_clk_0_1 [get_bd_ports ap_clk] \
  [get_bd_pins StreamingFIFO_rtl_0/ap_clk] [get_bd_pins StreamingMaxPool_hls_0/ap_clk] \
  [get_bd_pins StreamingFIFO_rtl_1/ap_clk] [get_bd_pins FMPadding_rtl_0/ap_clk] [get_bd_pins StreamingFIFO_rtl_2/ap_clk] \
  [get_bd_pins ConvolutionInputGenerator_rtl_0/ap_clk] [get_bd_pins StreamingFIFO_rtl_3/ap_clk] \
  [get_bd_pins StreamingDataWidthConverter_rtl_0/ap_clk] [get_bd_pins StreamingFIFO_rtl_4/ap_clk] \
  [get_bd_pins MVAU_hls_0/ap_clk] [get_bd_pins StreamingFIFO_rtl_5/ap_clk] [get_bd_pins StreamingMaxPool_hls_1/ap_clk] \
  [get_bd_pins StreamingFIFO_rtl_6/ap_clk] [get_bd_pins FMPadding_rtl_1/ap_clk] [get_bd_pins StreamingFIFO_rtl_7/ap_clk] \
  [get_bd_pins StreamingDataWidthConverter_rtl_1/ap_clk] [get_bd_pins StreamingFIFO_rtl_8/ap_clk] \
  [get_bd_pins ConvolutionInputGenerator_rtl_1/ap_clk] [get_bd_pins StreamingFIFO_rtl_9/ap_clk] \
  [get_bd_pins StreamingDataWidthConverter_hls_0/ap_clk] [get_bd_pins StreamingFIFO_rtl_10/ap_clk] \
  [get_bd_pins MVAU_hls_1/ap_clk] [get_bd_pins StreamingFIFO_rtl_11/ap_clk] \
  [get_bd_pins StreamingDataWidthConverter_rtl_2/ap_clk] [get_bd_pins StreamingFIFO_rtl_12/ap_clk] \
  [get_bd_pins StreamingMaxPool_hls_2/ap_clk] [get_bd_pins StreamingFIFO_rtl_13/ap_clk] [get_bd_pins FMPadding_rtl_2/ap_clk] \
  [get_bd_pins StreamingFIFO_rtl_14/ap_clk] [get_bd_pins StreamingDataWidthConverter_rtl_3/ap_clk] \
  [get_bd_pins StreamingFIFO_rtl_15/ap_clk] [get_bd_pins ConvolutionInputGenerator_rtl_2/ap_clk] \
  [get_bd_pins StreamingFIFO_rtl_16/ap_clk] [get_bd_pins StreamingDataWidthConverter_hls_1/ap_clk] \
  [get_bd_pins StreamingFIFO_rtl_17/ap_clk] [get_bd_pins MVAU_hls_2/ap_clk] [get_bd_pins StreamingFIFO_rtl_18/ap_clk] \
  [get_bd_pins StreamingDataWidthConverter_rtl_4/ap_clk] [get_bd_pins StreamingFIFO_rtl_19/ap_clk] \
  [get_bd_pins StreamingMaxPool_hls_3/ap_clk] [get_bd_pins StreamingFIFO_rtl_20/ap_clk] [get_bd_pins FMPadding_rtl_3/ap_clk] \
  [get_bd_pins StreamingFIFO_rtl_21/ap_clk] [get_bd_pins StreamingDataWidthConverter_rtl_5/ap_clk] \
  [get_bd_pins StreamingFIFO_rtl_22/ap_clk] [get_bd_pins ConvolutionInputGenerator_rtl_3/ap_clk] \
  [get_bd_pins StreamingFIFO_rtl_23/ap_clk] [get_bd_pins StreamingDataWidthConverter_rtl_6/ap_clk] \
  [get_bd_pins StreamingFIFO_rtl_24/ap_clk] [get_bd_pins MVAU_hls_3/ap_clk] [get_bd_pins StreamingFIFO_rtl_25/ap_clk] \
  [get_bd_pins StreamingDataWidthConverter_rtl_7/ap_clk] [get_bd_pins StreamingFIFO_rtl_26/ap_clk] \
  [get_bd_pins StreamingMaxPool_hls_4/ap_clk] [get_bd_pins StreamingFIFO_rtl_27/ap_clk] [get_bd_pins FMPadding_rtl_4/ap_clk] \
  [get_bd_pins StreamingFIFO_rtl_28/ap_clk] [get_bd_pins StreamingDataWidthConverter_rtl_8/ap_clk] \
  [get_bd_pins StreamingFIFO_rtl_29/ap_clk] [get_bd_pins ConvolutionInputGenerator_rtl_4/ap_clk] \
  [get_bd_pins StreamingFIFO_rtl_30/ap_clk] [get_bd_pins StreamingDataWidthConverter_rtl_9/ap_clk] \
  [get_bd_pins StreamingFIFO_rtl_31/ap_clk] [get_bd_pins MVAU_hls_4/ap_clk] [get_bd_pins StreamingFIFO_rtl_32/ap_clk] \
  [get_bd_pins StreamingDataWidthConverter_rtl_10/ap_clk] [get_bd_pins StreamingFIFO_rtl_33/ap_clk] \
  [get_bd_pins FMPadding_rtl_5/ap_clk] [get_bd_pins StreamingFIFO_rtl_34/ap_clk] \
  [get_bd_pins StreamingDataWidthConverter_rtl_11/ap_clk] [get_bd_pins StreamingFIFO_rtl_35/ap_clk] \
  [get_bd_pins ConvolutionInputGenerator_rtl_5/ap_clk] [get_bd_pins StreamingFIFO_rtl_36/ap_clk] \
  [get_bd_pins StreamingDataWidthConverter_rtl_12/ap_clk] [get_bd_pins StreamingFIFO_rtl_37/ap_clk] \
  [get_bd_pins MVAU_hls_5/ap_clk] [get_bd_pins StreamingFIFO_rtl_38/ap_clk] \
  [get_bd_pins StreamingDataWidthConverter_hls_2/ap_clk] [get_bd_pins StreamingFIFO_rtl_39/ap_clk] \
  [get_bd_pins MVAU_hls_6/ap_clk] [get_bd_pins StreamingFIFO_rtl_40/ap_clk] \
  [get_bd_pins StreamingDataWidthConverter_rtl_13/ap_clk] [get_bd_pins StreamingFIFO_rtl_41/ap_clk] \
  [get_bd_pins FMPadding_rtl_6/ap_clk] [get_bd_pins StreamingFIFO_rtl_42/ap_clk] \
  [get_bd_pins StreamingDataWidthConverter_rtl_14/ap_clk] [get_bd_pins StreamingFIFO_rtl_43/ap_clk] \
  [get_bd_pins ConvolutionInputGenerator_rtl_6/ap_clk] [get_bd_pins StreamingFIFO_rtl_44/ap_clk] \
  [get_bd_pins StreamingDataWidthConverter_rtl_15/ap_clk] [get_bd_pins StreamingFIFO_rtl_45/ap_clk] \
  [get_bd_pins MVAU_hls_7/ap_clk] [get_bd_pins StreamingFIFO_rtl_46/ap_clk] \
  [get_bd_pins StreamingDataWidthConverter_rtl_16/ap_clk] [get_bd_pins StreamingFIFO_rtl_47/ap_clk] \
  [get_bd_pins FMPadding_rtl_7/ap_clk] [get_bd_pins StreamingFIFO_rtl_48/ap_clk] \
  [get_bd_pins StreamingDataWidthConverter_rtl_17/ap_clk] [get_bd_pins StreamingFIFO_rtl_49/ap_clk] \
  [get_bd_pins ConvolutionInputGenerator_rtl_7/ap_clk] [get_bd_pins StreamingFIFO_rtl_50/ap_clk] \
  [get_bd_pins StreamingDataWidthConverter_rtl_18/ap_clk] [get_bd_pins StreamingFIFO_rtl_51/ap_clk] \
  [get_bd_pins MVAU_hls_8/ap_clk] [get_bd_pins StreamingFIFO_rtl_52/ap_clk]
